# EAGLE design 505_outin_kinoma (EAGLE 7.4.0)
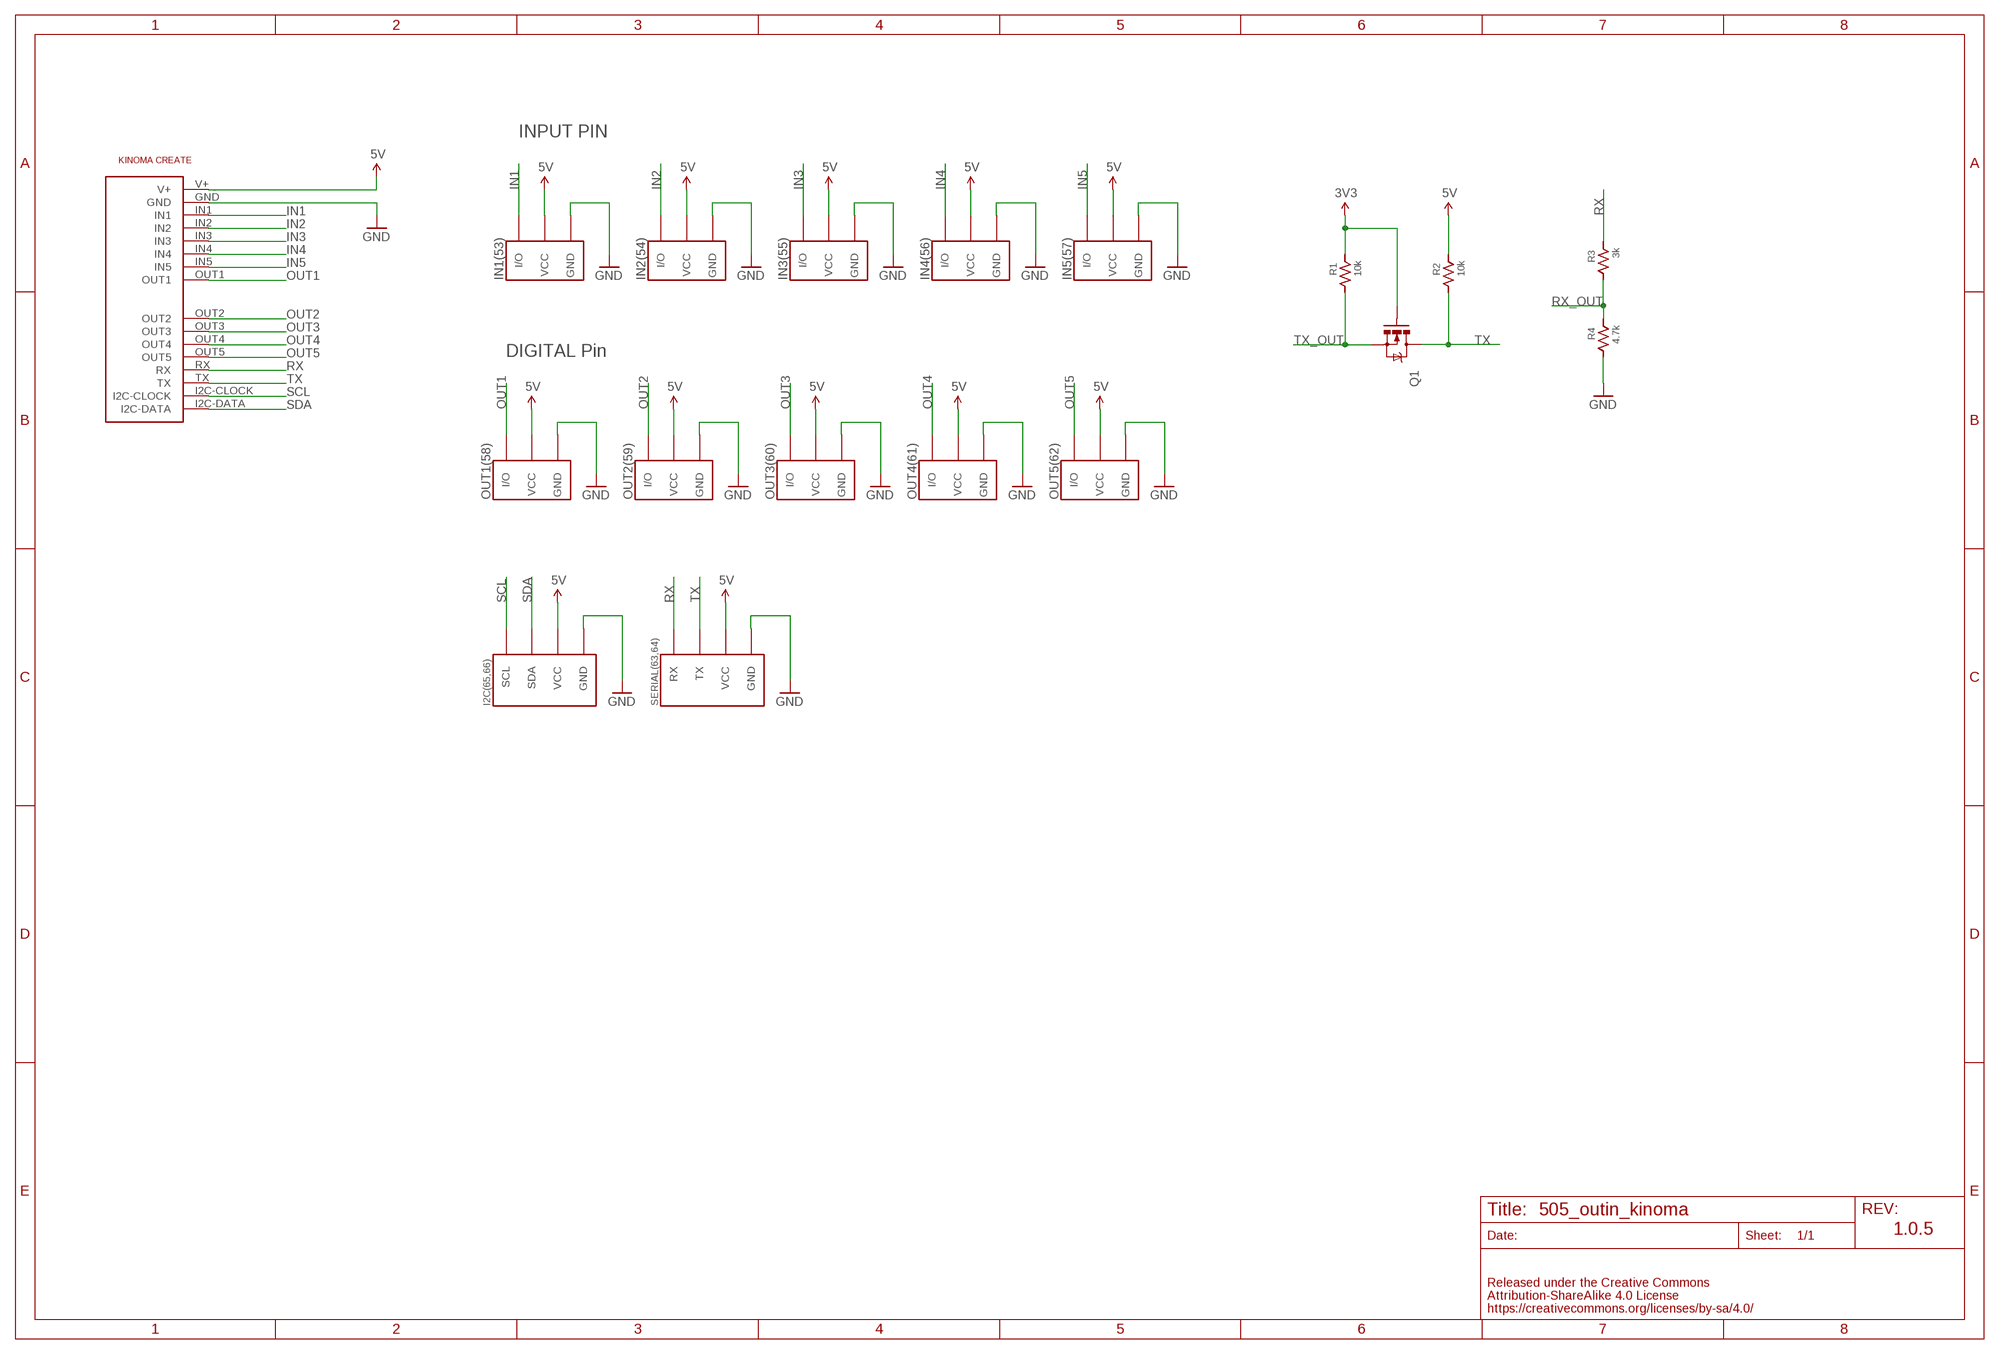
[diagram p0: schematic, sheet 1]

## Parts
I2C(65,66)  I2C  FABO_BRICK_I2C-S04B-PASK-2  [FABO_BRICK_I2C_S04B-PASK-2]
IN1(53)  FABO_BRICK_3PIN-B03B-PASK-1  [FABO_BRICK_3PIN_B03B-PASK-1]
IN2(54)  FABO_BRICK_3PIN-B03B-PASK-1  [FABO_BRICK_3PIN_B03B-PASK-1]
IN3(55)  FABO_BRICK_3PIN-B03B-PASK-1  [FABO_BRICK_3PIN_B03B-PASK-1]
IN4(56)  FABO_BRICK_3PIN-B03B-PASK-1  [FABO_BRICK_3PIN_B03B-PASK-1]
IN5(57)  FABO_BRICK_3PIN-B03B-PASK-1  [FABO_BRICK_3PIN_B03B-PASK-1]
OUT1(58)  FABO_BRICK_3PIN-B03B-PASK-1  [FABO_BRICK_3PIN_B03B-PASK-1]
OUT2(59)  FABO_BRICK_3PIN-B03B-PASK-1  [FABO_BRICK_3PIN_B03B-PASK-1]
OUT3(60)  FABO_BRICK_3PIN-B03B-PASK-1  [FABO_BRICK_3PIN_B03B-PASK-1]
OUT4(61)  FABO_BRICK_3PIN-B03B-PASK-1  [FABO_BRICK_3PIN_B03B-PASK-1]
OUT5(62)  FABO_BRICK_3PIN-B03B-PASK-1  [FABO_BRICK_3PIN_B03B-PASK-1]
Q1  MOSFET-N-BSS138  [SOT23-3]
R1  10k  RESISTOR-0402  [0402]
R2  10k  RESISTOR-0402  [0402]
R3  3k  RESISTOR-0402  [0402]
R4  4.7k  RESISTOR-0402  [0402]
SERIAL(63,64)  FABO_BRICK_SERIAL-S04B-PASK-2  [FABO_BRICK_SERIAL_S04B-PASK-2]
U$18  FABO-KINOMA  [FABO-KINOMA]

## Nets
3V3: Q1.1(G) R1.P$2
5V: I2C(65,66).VCC IN1(53).VCC IN2(54).VCC IN3(55).VCC IN4(56).VCC IN5(57).VCC OUT1(58).VCC OUT2(59).VCC OUT3(60).VCC OUT4(61).VCC OUT5(62).VCC R2.P$2 SERIAL(63,64).VCC U$18.V+
GND: I2C(65,66).GND IN1(53).GND IN2(54).GND IN3(55).GND IN4(56).GND IN5(57).GND OUT1(58).GND OUT2(59).GND OUT3(60).GND OUT4(61).GND OUT5(62).GND R4.P$1 SERIAL(63,64).GND U$18.GND
IN1: IN1(53).I/O U$18.IN1
IN2: IN2(54).I/O U$18.IN2
IN3: IN3(55).I/O U$18.IN3
IN4: IN4(56).I/O U$18.IN4
IN5: IN5(57).I/O U$18.IN5
OUT1: OUT1(58).I/O U$18.OUT1
OUT2: OUT2(59).I/O U$18.OUT2
OUT3: OUT3(60).I/O U$18.OUT3
OUT4: OUT4(61).I/O U$18.OUT4
OUT5: OUT5(62).I/O U$18.OUT5
RX: R3.P$2 SERIAL(63,64).RX U$18.RX
RX_OUT: R3.P$1 R4.P$2
SCL: I2C(65,66).SCL U$18.I2C-CLOCK
SDA: I2C(65,66).SDA U$18.I2C-DATA
TX: Q1.3(D) R2.P$1 SERIAL(63,64).TX U$18.TX
TX_OUT: Q1.2(S) R1.P$1

## Notes on the sheet
- INPUT PIN
- DIGITAL Pin
- 1.0.5

## Library data of the parts
I2C(65,66) = FaBo-Template:FABO_BRICK_I2C: FaBo Brick I2C
IN1(53) IN2(54) IN3(55) IN4(56) IN5(57) OUT1(58) OUT2(59) OUT3(60) OUT4(61) OUT5(62) = FaBo-Template:FABO_BRICK_3PIN: FaBo Brick 3pin
Q1 = FaBo-etc:MOSFET-N
R1-R4 = FaBo-Resistors:RESISTOR: RESISTOR
SERIAL(63,64) = FaBo-Template:FABO_BRICK_SERIAL: FaBo Brick Serial
U$18 = FaBo-Template:FABO-KINOMA

## Board
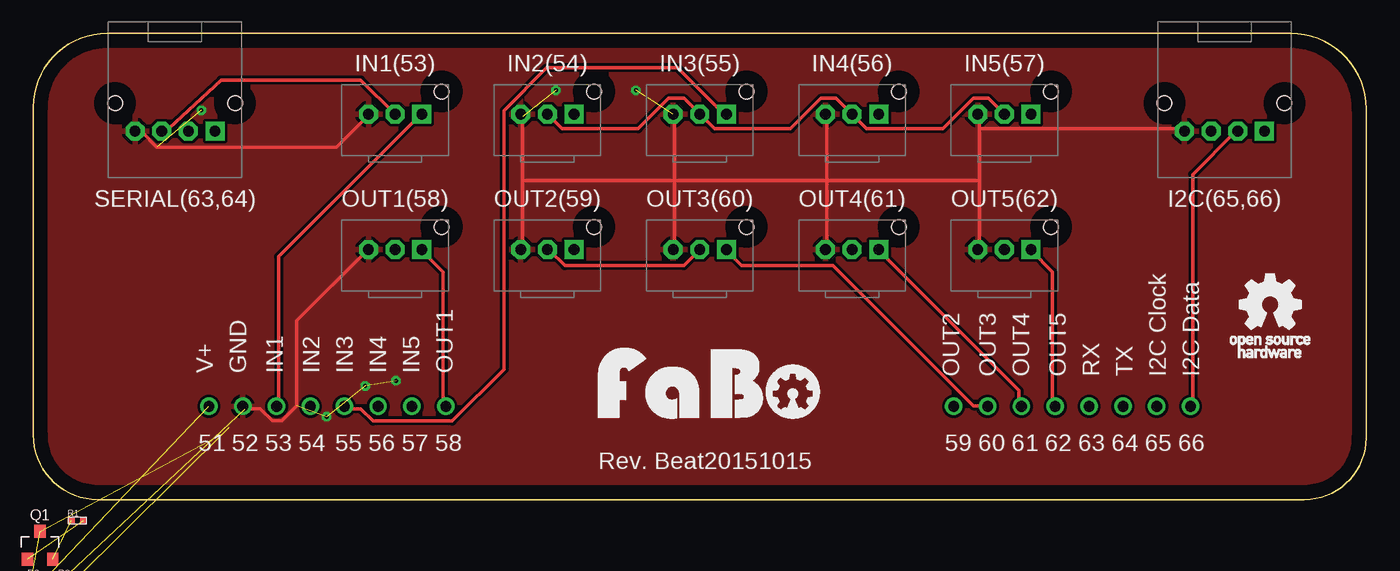
[diagram p1: board, top side]
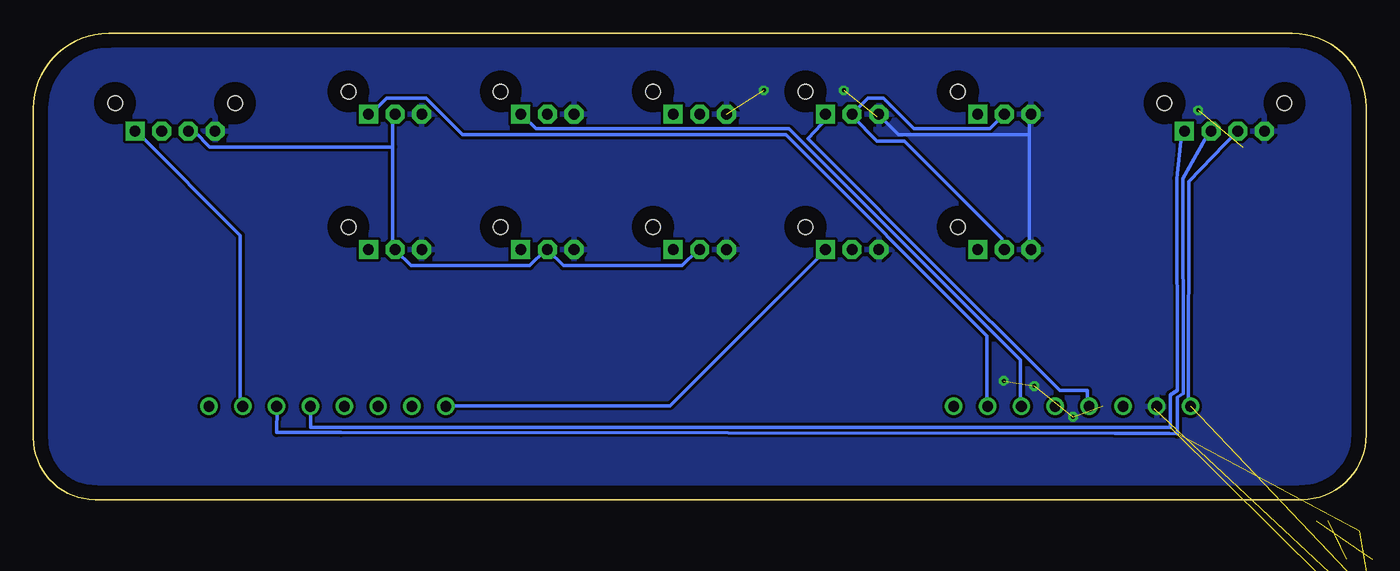
[diagram p2: board, bottom side, seen from below]

Size 100 x 35 mm. Coordinates in mm from the lower left corner, seen from the top.
Copper layers (1*16): Top 0.035mm / dielectric 1.5mm / Bottom 0.035mm
Design rules "default": minimum track width 10mil, minimum drill 24mil, track to track 8mil, track to pad 8mil, pad to pad 8mil, via to via 8mil, smd to smd 8mil, copper to edge 40mil, drill to drill 8mil, minimum pad ring 10mil, minimum via ring 8mil, stop-mask expansion 4mil, vias tented up to drill 0mil, thermal gap 10mil

### Footprints (pad centres in the part's own frame; a part is rotated, then mirrored left to right if it is on the bottom)
FABO_BRICK_I2C_S04B-PASK-2 = drill 0.8 pad 1.422 octagon: GND -3,0; SDA 1,0; VCC -1,0 | drill 0.8 pad 1.422 square: SCL 3,0 | hole 1.1: 4.5,2.1; -4.5,2.1
FABO_BRICK_3PIN_B03B-PASK-1 = drill 0.8 pad 1.422 octagon: GND -2,0; VCC 0,0 | drill 0.8 pad 1.422 square: I/O 2,0 | hole 1.1: 3.5,1.7
SOT23-3 = smd 0.85 x 0.95: 1 -0.95,-1; 2 0.95,-1; 3 0,1.1
0402 = smd 0.5 x 0.5: P$1 -0.46,0; P$2 0.46,0
FABO_BRICK_SERIAL_S04B-PASK-2 = drill 0.8 pad 1.422 octagon: GND -3,0; TX 1,0; VCC -1,0 | drill 0.8 pad 1.422 square: RX 3,0 | hole 1.1: 4.5,2.1; -4.5,2.1
FABO-KINOMA = drill 0.8: GND -34.29,-10.5; I2C-CLOCK 34.29,-10.5; I2C-DATA 36.83,-10.5; IN1 -31.75,-10.5; IN2 -29.21,-10.5; IN3 -26.67,-10.5; IN4 -24.13,-10.5; IN5 -21.59,-10.5; OUT1 -19.05,-10.5; OUT2 19.05,-10.5; OUT3 21.59,-10.5; OUT4 24.13,-10.5; OUT5 26.67,-10.5; RX 29.21,-10.5; TX 31.75,-10.5; V+ -36.83,-10.5

### Placement (x,y rotation side)
I2C(65,66)  89.37,27.66 0 top
IN1(53)  27.14,28.93 0 top
IN2(54)  38.57,28.93 0 top
IN3(55)  50,28.93 0 top
IN4(56)  61.43,28.93 0 top
IN5(57)  72.86,28.93 0 top
OUT1(58)  27.14,18.77 0 top
OUT2(59)  38.57,18.77 0 top
OUT3(60)  50,18.77 0 top
OUT4(61)  61.43,18.77 0 top
OUT5(62)  72.86,18.77 0 top
Q1  0.5,-3.48 0 top
R1  3.3,-1.58 0 top
R2  0.3,-6.08 0 top  (outside the outline)
R3  2.6,-6.08 0 top  (outside the outline)
R4  0.3,-8.18 0 top  (outside the outline)
SERIAL(63,64)  10.63,27.66 0 top
U$2  [LOGO_FABO_L]  50,6.07 0 top
U$3  [LOGO_OSHW_T_M]  92.8,14.62 0 top
U$18  50,17.5 0 top

### Tracks (layer width: path | path; a pad name or v marks a point on that pad's centre or on a via)
3V3  (1 unrouted)
5V  (1 unrouted)
  Top 0.254: OUT2(59).VCC 38.75,18.69 39.89,17.55 48.81,17.55 49.95,18.69 OUT3(60).VCC | IN5(57).VCC 71.67,30.12 70.52,30.12 68.24,27.84 62.52,27.84 IN4(56).VCC 60.24,30.12 59.09,30.12 56.81,27.84 51.09,27.84 IN3(55).VCC 48.81,30.12 47.66,30.12 45.38,27.84 39.66,27.84 IN2(54).VCC | IN1(53).VCC 24.58,31.49 14.08,31.49 10.17,27.84 9.72,27.84 SERIAL(63,64).VCC
  Bottom 0.254: U$18.V+ 13.35,6.93 13.3,23.88 9.72,27.61 SERIAL(63,64).VCC | OUT1(58).VCC 27.32,18.92 27.32,19.61 34.63,26.92 36.69,26.92 38.52,28.75 IN2(54).VCC 37.38,30.12 36.23,30.12 33.95,27.84 28.23,27.84 IN1(53).VCC | 73.04,26.47 73.04,18.92 OUT5(62).VCC 72.81,18.69 71.67,17.55 62.75,17.55 61.61,18.69 OUT4(61).VCC 61.38,18.69 60.24,17.55 51.32,17.55 50.18,18.69 OUT3(60).VCC | 73.04,26.47 73.04,28.75 IN5(57).VCC | 73.04,26.47 86.75,26.47 87.9,27.61 88.35,27.61 I2C(65,66).VCC
GND  (via drill 0.3)  (7 unrouted)
  Top 0.254: SERIAL(63,64).GND 7.66,27.61 8.12,27.61 9.26,26.47 22.75,26.47 25.03,28.75 IN1(53).GND | U$18.GND 15.89,6.81 17.03,6.81 17.95,5.89 18.63,5.89 19.77,7.03 19.77,13.44 25.03,18.69 OUT1(58).GND | 70.98,27.84 70.98,28.75 IN5(57).GND | 70.98,27.84 70.98,23.95 | 70.98,23.95 70.98,18.92 OUT5(62).GND | 70.98,27.84 86.3,27.84 I2C(65,66).GND | 59.55,23.95 59.55,28.75 IN4(56).GND | 59.55,23.95 59.55,18.92 OUT4(61).GND | 36.69,23.95 36.69,28.75 IN2(54).GND | 36.69,23.95 36.69,18.92 OUT2(59).GND | 48.12,23.95 48.12,28.75 IN3(55).GND | 48.12,23.95 48.12,18.92 OUT3(60).GND | 48.12,23.95 36.69,23.95 | 48.12,23.95 59.55,23.95 | 59.55,23.95 70.98,23.95
  Bottom 0.254: 25.26,27.38 25.26,18.92 OUT1(58).GND | 25.26,27.38 25.26,28.75 IN1(53).GND | 25.26,27.38 35.09,27.38 36.46,28.75 IN2(54).GND
  other vias: 45.2,30.72 39.2,30.72 12.6,29.22 24.9,8.52 27.2,8.92 22,6.22
  pour Top: -0.8,-0.28 100.2,-0.28 100.2,35.72 -0.8,35.72
  pour Bottom: -0.8,-0.28 100.2,-0.28 100.2,35.72 -0.8,35.72
IN1
  Top 0.254: U$18.IN1 18.4,7.03 18.4,18.24 28.92,28.75 IN1(53).I/O
IN2
  Bottom 0.254: U$18.IN2 20.92,7.03 20.92,8.18 22.97,8.18 33.34,18.52 39.61,24.81 41.87,27.1 40.35,28.75 IN2(54).I/O
IN3
  Top 0.254: U$18.IN3 23.43,6.81 24.58,6.81 25.49,5.89 31.43,5.89 35.32,9.78 35.32,29.21 38.52,32.41 48.35,32.41 51.78,28.98 IN3(55).I/O
IN4
  Bottom 0.254: U$18.IN4 25.95,7.03 25.95,10.46 43.32,27.84 62.29,27.84 63.21,28.75 IN4(56).I/O
IN5
  Bottom 0.254: U$18.IN5 28.46,7.03 28.46,12.29 43.55,27.38 67.78,27.38 70.52,30.12 73.5,30.12 74.64,28.98 IN5(57).I/O
OUT1
  Top 0.254: U$18.OUT1 30.75,7.03 30.75,17.09 29.15,18.69 OUT1(58).I/O
OUT2
  Bottom 0.254: U$18.OUT2 68.92,7.03 52.23,7.03 40.58,18.69 OUT2(59).I/O
OUT3
  Top 0.254: U$18.OUT3 71.44,7.03 70.52,7.03 60.01,17.55 53.15,17.55 52.01,18.69 OUT3(60).I/O
OUT4
  Top 0.254: U$18.OUT4 73.95,7.03 73.95,8.18 63.44,18.69 OUT4(61).I/O
OUT5
  Top 0.254: U$18.OUT5 76.47,7.03 76.47,17.09 74.87,18.69 OUT5(62).I/O
RX  (1 unrouted)
  Bottom 0.254: U$18.RX 79.21,5.43 76.7,5.43 20.28,5.41 19.32,5.43 14.69,5.43 14.69,7.87 14.19,8.18 14.21,24.1 13.83,27.61 SERIAL(63,64).RX
RX_OUT  (1 unrouted)
SCL
  Bottom 0.254: U$18.I2C-CLOCK 84.47,7.03 84.47,19.84 92.24,27.61 I2C(65,66).SCL
SDA
  Top 0.254: U$18.I2C-DATA 86.98,7.03 86.98,24.41 90.18,27.61 I2C(65,66).SDA
TX  (2 unrouted)
  Bottom 0.254: U$18.TX 81.73,6.81 81.75,5.03 76.92,5.03 18.86,4.98 14.77,4.98 14.19,4.93 14.16,7.67 13.73,7.97 13.73,9.02 13.75,24.1 11.77,27.61 SERIAL(63,64).TX
TX_OUT  (1 unrouted)

### Text on the board
tPlace: Rev. Beat20151015